# EAGLE design spi_current_sensor (EAGLE 7.4.0)
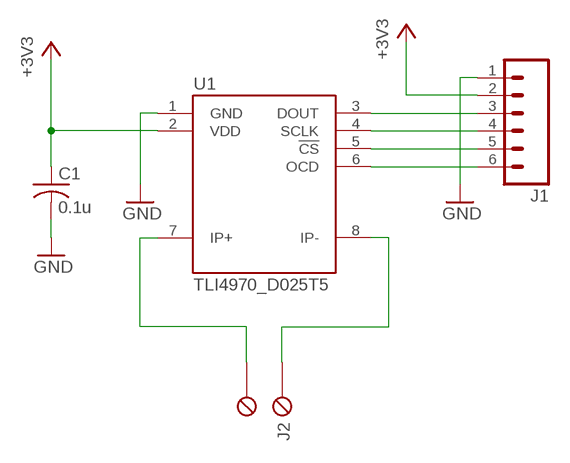
[diagram p0: schematic, sheet 1]

## Parts
C1  0.1u  C-US025-025X050  [C025-025X050]
J1  M06LONGPADS  [1X06_LONGPADS]
J2  METALTEX-2  [METALTEX-2]
U1  TLI4970_D025T5  [TLI4970_D025T5]

## Nets
+3V3: C1.1 J1.2 U1.2(VDD)
GND: C1.2 J1.1 U1.1(GND)
N$1: J1.3 U1.3(DOUT)
N$2: J1.4 U1.4(SCLK)
N$3: J1.5 U1.5(!CS)
N$4: J1.6 U1.6(OCD)
N$5: J2.P2 U1.7(IP+)
N$6: J2.P1 U1.8(IP-)

## Library data of the parts
C1 = adafruit:C-US: CAPACITOR, American symbol
J1 = uchile_robotics_eagle_lib:M06: Header 6 Standard 6-pin 0.1" header. Use with straight break away headers (SKU : PRT-00116), right angle break away headers (PRT-00553), swiss pins (PRT-00743), machine pins (PRT-00117), and female headers (PRT-00115). Molex polarized connector foot print use with SKU : PRT-08094 with associated crimp pins and housings. NOTES ON THE VARIANTS LOCK and LOCK_LONGPADS... This footprint was designed to help hold the alignment of a through-hole component (i.e. 6-pin header) while soldering it into place. You may notice that each hole has been shifted either up or down by 0.005 of an inch from it's more standard position (which is a perfectly straight line). This slight alteration caused the pins (the squares in the middle) to touch the edges of the holes. Because they are alternating, it causes a "brace" to hold the component in place. 0.005 has proven to be the perfect amount of "off-center" position when using our standard breakaway headers. Although looks a little odd when you look at the bare footprint, once you have a header in there, the alteration is very hard to notice. Also,if you push a header all the way into place, it is covered up entirely on the bottom side. This idea of altering the position of holes to aid alignment will be further integrated into the Sparkfun Library for other footprints. It can help hold any component with 3 or more connection pins.
J2 = uchile_robotics_eagle_lib:METALTEX-2
U1 = uchile_robotics_eagle_lib:TLI4970_D025T5: TLI4970-D025T5 Miniature coreless magnetic current sensor for AC and DC measurements with digital interface and fast overcurrent detection.

## Board
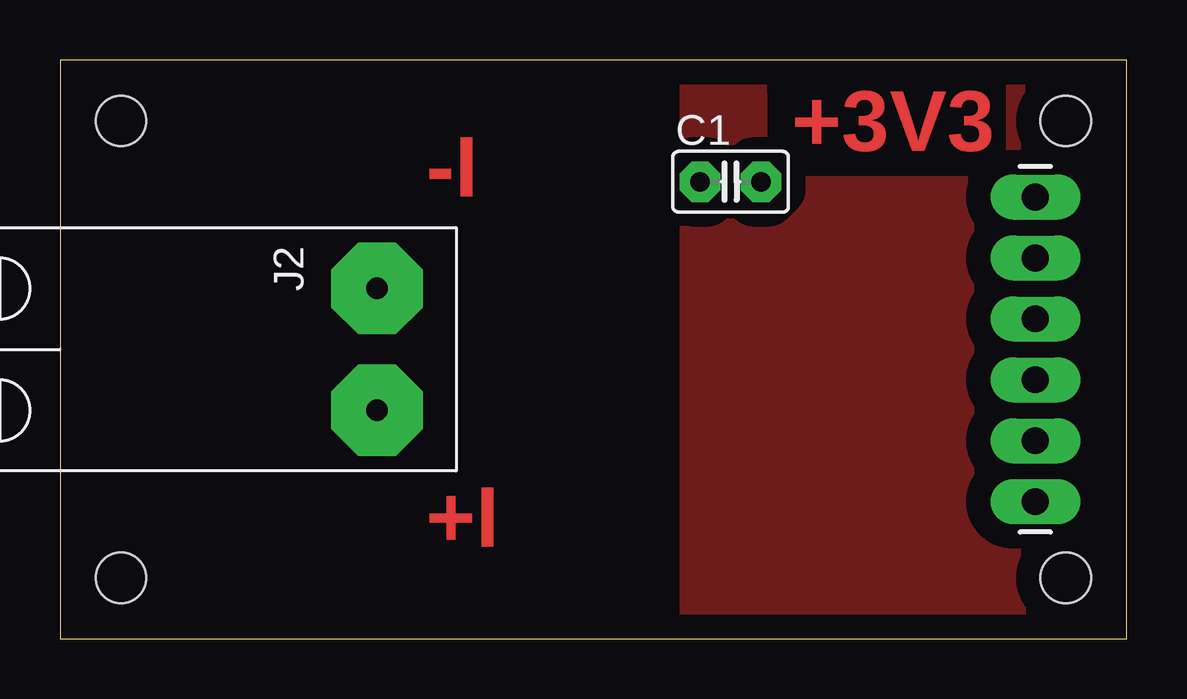
[diagram p1: board, top side]
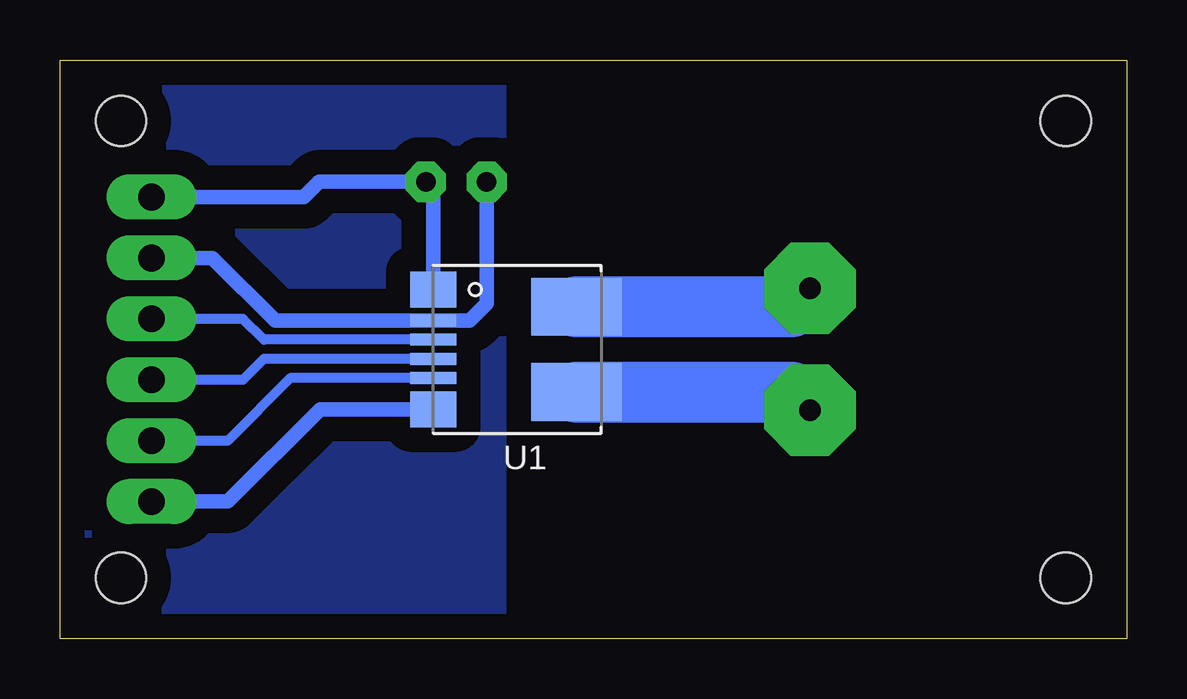
[diagram p2: board, bottom side, seen from below]

Size 44.45 x 24.13 mm. Coordinates in mm from the lower left corner, seen from the top.
Outline: 0,0 44.45,0 44.45,24.13 0,24.13 0,0
Copper layers (1*16): Top 0.035mm / dielectric 1.5mm / Bottom 0.035mm
Design rules "default": minimum track width 10mil, minimum drill 24mil, track to track 8mil, track to pad 8mil, pad to pad 8mil, via to via 8mil, smd to smd 8mil, copper to edge 40mil, drill to drill 8mil, minimum pad ring 10mil, minimum via ring 8mil, stop-mask expansion 4mil, vias tented up to drill 0mil, thermal gap 10mil
Holes 2.1 mm at 2.54,21.59 2.54,2.54 41.91,21.59 41.91,2.54

### Footprints (pad centres in the part's own frame; a part is rotated, then mirrored left to right if it is on the bottom)
C025-025X050 = drill 0.813 pad 1.676 octagon: 1 -1.27,0; 2 1.27,0
1X06_LONGPADS = drill 1.118 pad 1.88 long: 1 0,0; 2 2.54,0; 3 5.08,0; 4 7.62,0; 5 10.16,0; 6 12.7,0
METALTEX-2 = drill 0.9 pad 3.81 octagon: P1 -2.54,1.778; P2 2.54,1.778
TLI4970_D025T5 = smd 1.5 x 1.9: 1 -2.5,-3.5; 6 2.5,-3.5 | smd 0.5 x 1.9: 2 -1.2,-3.5; 3 -0.4,-3.5; 4 0.4,-3.5; 5 1.2,-3.5 | smd 2.4 x 3.78: 7 1.78,2.47; 8 -1.78,2.47

### Placement (x,y rotation side)
C1  27.94,19.05 0 top
J1  40.64,18.41 270 top
J2  11.43,12.06 270 top
U1  25.4,12.06 270 bottom

### Tracks (layer width: path | path; a pad name or v marks a point on that pad's centre or on a via)
+3V3
  Bottom 0.61: J1.2 38.1,15.88 35.49,13.27 U1.2 27.38,13.27 26.67,13.97 C1.1
GND
  Bottom 0.406: 28.9,18.74 C1.2
  Bottom 0.61: U1.1 28.9,18.74 | C1.2 33.66,19.05 34.29,18.41 J1.1
N$1
  Bottom 0.406: U1.3 35.96,12.46 36.83,13.34 J1.3
N$2
  Bottom 0.406: U1.4 35.96,11.66 36.83,10.79 J1.4
N$3
  Bottom 0.406: U1.5 34.85,10.87 37.47,8.26 J1.5
N$4
  Bottom 0.61: U1.6 33.62,9.56 37.47,5.71 J1.6
N$5
  Bottom 2.54: U1.7 13.97,10.29 J2.P2
N$6
  Bottom 2.54: U1.8 13.97,13.85 J2.P1
N$7
  pour Bottom (isolate 1.016): 26.04,24.13 44.45,24.13 44.45,0 26.04,0
N$8
  pour Top (isolate 1.016): 26.04,24.13 44.45,24.13 44.45,0 26.04,0

### Text on the board
Top: +3V3 | -I | +I